# Altium schematic sheet CONTROL_ROUTING_CROSSPOINTS.SchDoc
size 381 x 304 mm; SheetNumber: 4; SheetTotal: 14
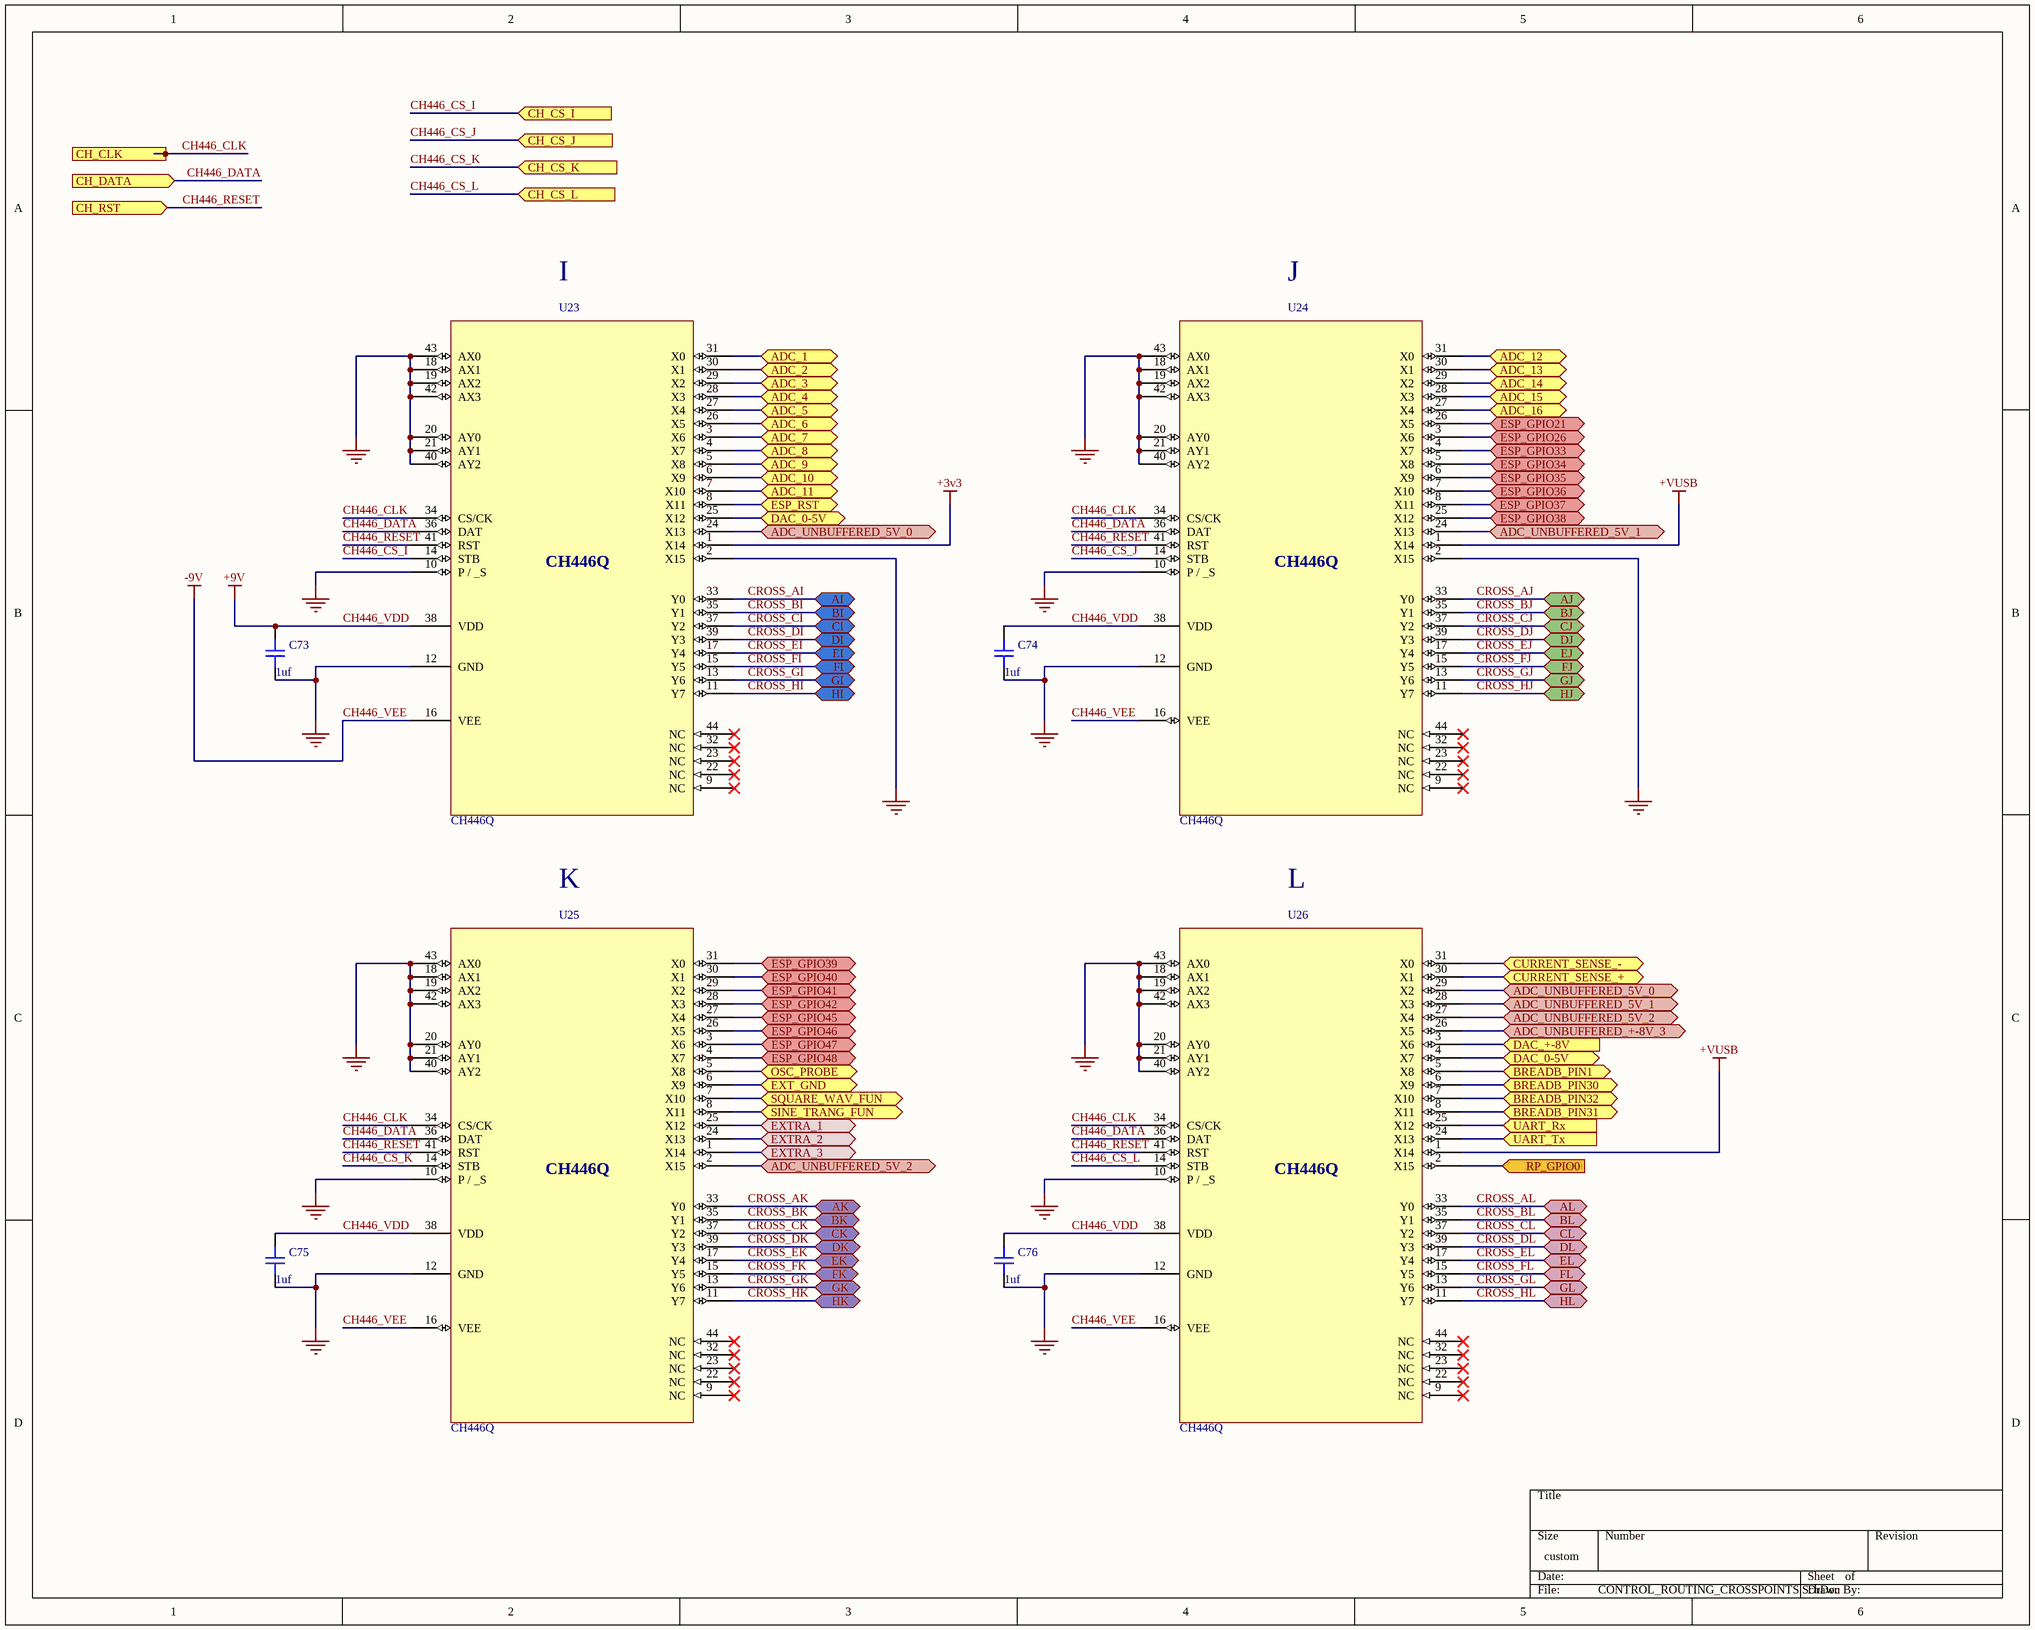
[diagram p0: CONTROL_ROUTING_CROSSPOINTS.SchDoc]

## Parts
C73  1uf  [CAP_0603]
C74  1uf  [CAP_0603]
C75  1uf  [CAP_0603]
C76  1uf  [CAP_0603]
U23  CH446Q  [PG-LQFP-44]
U24  CH446Q  [PG-LQFP-44]
U25  CH446Q  [PG-LQFP-44]
U26  CH446Q  [PG-LQFP-44]

## Ports
ADC_1 (bidir), ADC_2 (bidir), ADC_3 (bidir), ADC_4 (bidir), ADC_5 (bidir), ADC_6 (bidir), ADC_7 (bidir), ADC_8 (bidir), ADC_9 (bidir), ADC_10 (bidir), ADC_11 (bidir), ADC_12 (bidir), ADC_13 (bidir), ADC_14 (bidir), ADC_15 (bidir), ADC_16 (bidir), ADC_UNBUFFERED_5V_0 (bidir), ADC_UNBUFFERED_5V_1 (bidir), ADC_UNBUFFERED_5V_2 (bidir), ADC_UNBUFFERED_+-8V_3 (bidir), AI (bidir), AJ (bidir), AK (bidir), AL (bidir), BI (bidir), BJ (bidir), BK (bidir), BL (bidir), BREADB_PIN1 (bidir), BREADB_PIN30 (bidir), BREADB_PIN31 (bidir), BREADB_PIN32 (bidir), CH_CLK (in), CH_CS_I (in), CH_CS_J (in), CH_CS_K (in), CH_CS_L (in), CH_DATA (in), CH_RST (in), CI (bidir), CJ (bidir), CK (bidir), CL (bidir), CURRENT_SENSE_+ (bidir), CURRENT_SENSE_- (bidir), DAC_0-5V (bidir), DAC_+-8V (in), DI (bidir), DJ (bidir), DK (bidir), DL (bidir), EI (bidir), EJ (bidir), EK (bidir), EL (bidir), ESP_GPIO21 (bidir), ESP_GPIO26 (bidir), ESP_GPIO33 (bidir), ESP_GPIO34 (bidir), ESP_GPIO35 (bidir), ESP_GPIO36 (bidir), ESP_GPIO37 (bidir), ESP_GPIO38 (bidir), ESP_GPIO39 (bidir), ESP_GPIO40 (bidir), ESP_GPIO41 (bidir), ESP_GPIO42 (bidir), ESP_GPIO45 (bidir), ESP_GPIO46 (bidir), ESP_GPIO47 (bidir), ESP_GPIO48 (bidir), ESP_RST (bidir), EXT_GND (bidir), EXTRA_1 (bidir), EXTRA_2 (bidir), EXTRA_3 (bidir), FI (bidir), FJ (bidir), FK (bidir), FL (bidir), GI (bidir), GJ (bidir), GK (bidir), GL (bidir), HI (bidir), HJ (bidir), HK (bidir), HL (bidir), OSC_PROBE (bidir), RP_GPIO0 (in), SINE_TRANG_FUN (bidir), SQUARE_WAV_FUN (bidir), UART_Rx (in), UART_Tx (in)

## Nets
+3v3: U23.1(X14)
+VUSB: U24.1(X14) U26.1(X14)
CH446_VDD: C73.2 C74.2 C75.2 C76.2 U23.38(VDD) U24.38(VDD) U25.38(VDD) U26.38(VDD)  [also labelled +9V]
CH446_VEE: U23.16(VEE) U24.16(VEE) U25.16(VEE) U26.16(VEE)  [also labelled -9V]
GND: C73.1 C74.1 C75.1 C76.1 U23.2(X15) U23.10(P_/__S) U23.12(GND) U23.18(AX1) U23.19(AX2) U23.20(AY0) U23.21(AY1) U23.40(AY2) U23.42(AX3) U23.43(AX0) U24.2(X15) U24.10(P_/__S) U24.12(GND) U24.18(AX1) U24.19(AX2) U24.20(AY0) U24.21(AY1) U24.40(AY2) U24.42(AX3) U24.43(AX0) U25.10(P_/__S) U25.12(GND) U25.18(AX1) U25.19(AX2) U25.20(AY0) U25.21(AY1) U25.40(AY2) U25.42(AX3) U25.43(AX0) U26.10(P_/__S) U26.12(GND) U26.18(AX1) U26.19(AX2) U26.20(AY0) U26.21(AY1) U26.40(AY2) U26.42(AX3) U26.43(AX0)
ADC_1: U23.31(X0) ; port ADC_1
ADC_2: U23.30(X1) ; port ADC_2
ADC_3: U23.29(X2) ; port ADC_3
ADC_4: U23.28(X3) ; port ADC_4
ADC_5: U23.27(X4) ; port ADC_5
ADC_6: U23.26(X5) ; port ADC_6
ADC_7: U23.3(X6) ; port ADC_7
ADC_8: U23.4(X7) ; port ADC_8
ADC_9: U23.5(X8) ; port ADC_9
ADC_10: U23.6(X9) ; port ADC_10
ADC_11: U23.7(X10) ; port ADC_11
ADC_12: U24.31(X0) ; port ADC_12
ADC_13: U24.30(X1) ; port ADC_13
ADC_14: U24.29(X2) ; port ADC_14
ADC_15: U24.28(X3) ; port ADC_15
ADC_16: U24.27(X4) ; port ADC_16
ADC_UNBUFFERED_5V_0: U23.24(X13) U26.29(X2) ; port ADC_UNBUFFERED_5V_0
ADC_UNBUFFERED_5V_1: U24.24(X13) U26.28(X3) ; port ADC_UNBUFFERED_5V_1
ADC_UNBUFFERED_5V_2: U25.2(X15) U26.27(X4) ; port ADC_UNBUFFERED_5V_2
ADC_UNBUFFERED_+-8V_3: U26.26(X5) ; port ADC_UNBUFFERED_+-8V_3
BREADB_PIN1: U26.5(X8) ; port BREADB_PIN1
BREADB_PIN30: U26.6(X9) ; port BREADB_PIN30
BREADB_PIN31: U26.8(X11) ; port BREADB_PIN31
BREADB_PIN32: U26.7(X10) ; port BREADB_PIN32
CH446_CLK: U23.34(CS/CK) U24.34(CS/CK) U25.34(CS/CK) U26.34(CS/CK) ; port CH_CLK
CH446_CS_I: U23.14(STB) ; port CH_CS_I
CH446_CS_J: U24.14(STB) ; port CH_CS_J
CH446_CS_K: U25.14(STB) ; port CH_CS_K
CH446_CS_L: U26.14(STB) ; port CH_CS_L
CH446_DATA: U23.36(DAT) U24.36(DAT) U25.36(DAT) U26.36(DAT) ; port CH_DATA
CH446_RESET: U23.41(RST) U24.41(RST) U25.41(RST) U26.41(RST) ; port CH_RST
CROSS_AI: U23.33(Y0) ; port AI
CROSS_AJ: U24.33(Y0) ; port AJ
CROSS_AK: U25.33(Y0) ; port AK
CROSS_AL: U26.33(Y0) ; port AL
CROSS_BI: U23.35(Y1) ; port BI
CROSS_BJ: U24.35(Y1) ; port BJ
CROSS_BK: U25.35(Y1) ; port BK
CROSS_BL: U26.35(Y1) ; port BL
CROSS_CI: U23.37(Y2) ; port CI
CROSS_CJ: U24.37(Y2) ; port CJ
CROSS_CK: U25.37(Y2) ; port CK
CROSS_CL: U26.37(Y2) ; port CL
CROSS_DI: U23.39(Y3) ; port DI
CROSS_DJ: U24.39(Y3) ; port DJ
CROSS_DK: U25.39(Y3) ; port DK
CROSS_DL: U26.39(Y3) ; port DL
CROSS_EI: U23.17(Y4) ; port EI
CROSS_EJ: U24.17(Y4) ; port EJ
CROSS_EK: U25.17(Y4) ; port EK
CROSS_EL: U26.17(Y4) ; port EL
CROSS_FI: U23.15(Y5) ; port FI
CROSS_FJ: U24.15(Y5) ; port FJ
CROSS_FK: U25.15(Y5) ; port FK
CROSS_FL: U26.15(Y5) ; port FL
CROSS_GI: U23.13(Y6) ; port GI
CROSS_GJ: U24.13(Y6) ; port GJ
CROSS_GK: U25.13(Y6) ; port GK
CROSS_GL: U26.13(Y6) ; port GL
CROSS_HI: U23.11(Y7) ; port HI
CROSS_HJ: U24.11(Y7) ; port HJ
CROSS_HK: U25.11(Y7) ; port HK
CROSS_HL: U26.11(Y7) ; port HL
CURRENT_SENSE_+: U26.30(X1) ; port CURRENT_SENSE_+
CURRENT_SENSE_-: U26.31(X0) ; port CURRENT_SENSE_-
DAC_0-5V: U23.25(X12) U26.4(X7) ; port DAC_0-5V
DAC_+-8V: U26.3(X6) ; port DAC_+-8V
ESP_GPIO21: U24.26(X5) ; port ESP_GPIO21
ESP_GPIO26: U24.3(X6) ; port ESP_GPIO26
ESP_GPIO33: U24.4(X7) ; port ESP_GPIO33
ESP_GPIO34: U24.5(X8) ; port ESP_GPIO34
ESP_GPIO35: U24.6(X9) ; port ESP_GPIO35
ESP_GPIO36: U24.7(X10) ; port ESP_GPIO36
ESP_GPIO37: U24.8(X11) ; port ESP_GPIO37
ESP_GPIO38: U24.25(X12) ; port ESP_GPIO38
ESP_GPIO39: U25.31(X0) ; port ESP_GPIO39
ESP_GPIO40: U25.30(X1) ; port ESP_GPIO40
ESP_GPIO41: U25.29(X2) ; port ESP_GPIO41
ESP_GPIO42: U25.28(X3) ; port ESP_GPIO42
ESP_GPIO45: U25.27(X4) ; port ESP_GPIO45
ESP_GPIO46: U25.26(X5) ; port ESP_GPIO46
ESP_GPIO47: U25.3(X6) ; port ESP_GPIO47
ESP_GPIO48: U25.4(X7) ; port ESP_GPIO48
ESP_RST: U23.8(X11) ; port ESP_RST
EXT_GND: U25.6(X9) ; port EXT_GND
EXTRA_1: U25.25(X12) ; port EXTRA_1
EXTRA_2: U25.24(X13) ; port EXTRA_2
EXTRA_3: U25.1(X14) ; port EXTRA_3
OSC_PROBE: U25.5(X8) ; port OSC_PROBE
RP_GPIO0: U26.2(X15) ; port RP_GPIO0
SINE_TRANG_FUN: U25.8(X11) ; port SINE_TRANG_FUN
SQUARE_WAV_FUN: U25.7(X10) ; port SQUARE_WAV_FUN
UART_Rx: U26.25(X12) ; port UART_Rx
UART_Tx: U26.24(X13) ; port UART_Tx

Not connected (* = marked no-connect by the designer): U23 9(NC)* 22(NC)* 23(NC)* 32(NC)* 44(NC)*; U24 9(NC)* 22(NC)* 23(NC)* 32(NC)* 44(NC)*; U25 9(NC)* 22(NC)* 23(NC)* 32(NC)* 44(NC)*; U26 9(NC)* 22(NC)* 23(NC)* 32(NC)* 44(NC)*

## Notes on the sheet
- I
- J
- K
- L

## Library data of the parts
C73-C76 = CAP_0603: Capacitor SMD 0603; Manufacturer: *; Manufacturer Part Number: *; Distributor Link: *; LCSC: *; Rating: *; Dielectric: *